# Altium schematic sheet Multiplexor_USBD_Maestro.SchDoc
size A4; SheetNumber: 17; SheetTotal: 22
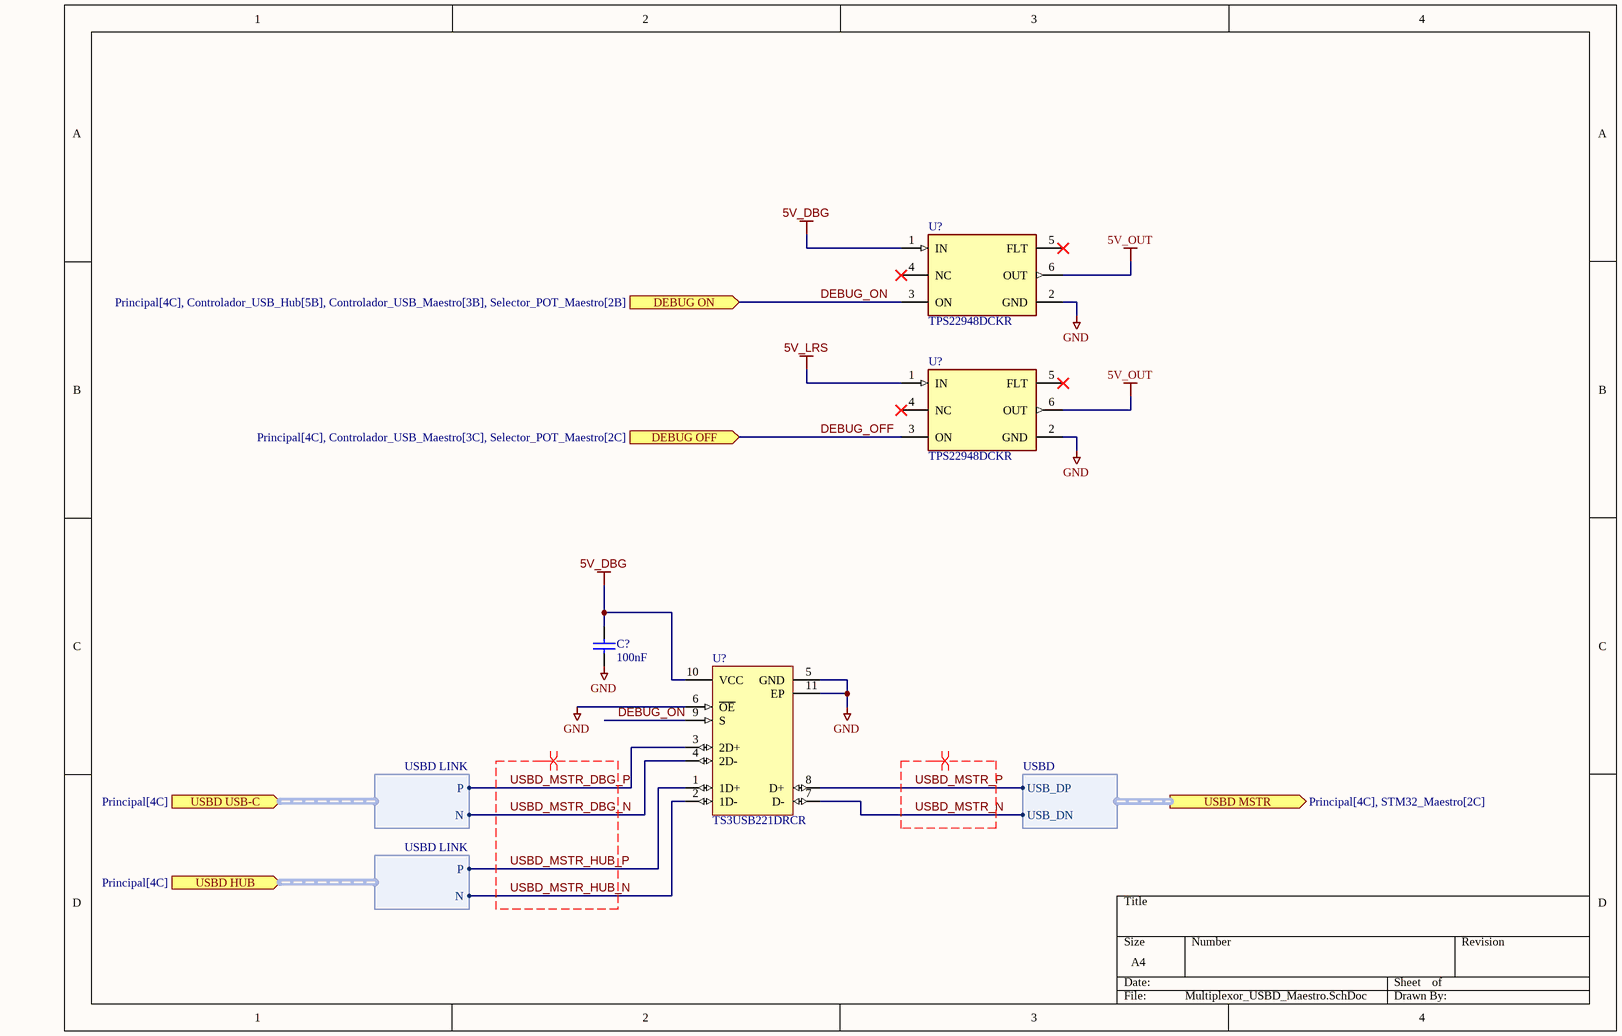
[diagram p0: Multiplexor_USBD_Maestro.SchDoc]

## Parts
(Parts that share a designator on the sheet are numbered #1, #2 ... from top to bottom, then left to right.)
C?  100nF  [CAPC1005X55X25NL05T05]
U?#1  TPS22948DCKR  [FP-DCK0006A-MFG]
U?#2  TPS22948DCKR  [FP-DCK0006A-MFG]
U?#3  TS3USB221DRCR  [DRC0010J_V]

## Ports
DEBUG OFF (in, see Principal[4C], Controlador_USB_Maestro[3C], Selector_POT_Maestro[2C]), DEBUG ON (in, see Principal[4C], Controlador_USB_Hub[5B], Controlador_USB_Maestro[3B], Selector_POT_Maestro[2B]), USBD HUB (in, harness USBD LINK, see Principal[4C]), USBD MSTR (out, harness USBD, see Principal[4C], STM32_Maestro[2C]), USBD USB-C (in, harness USBD LINK, see Principal[4C])

## Harnesses
USBD: USB_DP, USB_DN
USBD LINK: P, N

## Nets
5V_DBG: C?.2 U?#1.1(IN) U?#3.10(VCC)
5V_LRS: U?#2.1(IN)
5V_OUT: U?#1.6(OUT) U?#2.6(OUT)
GND: C?.1 U?#1.2(GND) U?#2.2(GND) U?#3.5(GND) U?#3.6(~{OE}) U?#3.11(EP)
DEBUG_OFF: U?#2.3(ON) ; port DEBUG OFF
DEBUG_ON: U?#1.3(ON) U?#3.9(S) ; port DEBUG ON
USBD_MSTR_DBG_N: U?#3.4(2D-) ; port USBD USB-C.N
USBD_MSTR_DBG_P: U?#3.3(2D+) ; port USBD USB-C.P
USBD_MSTR_HUB_N: U?#3.2(1D-) ; port USBD HUB.N
USBD_MSTR_HUB_P: U?#3.1(1D+) ; port USBD HUB.P
USBD_MSTR_N: U?#3.7(D-) ; port USBD MSTR.USB_DN
USBD_MSTR_P: U?#3.8(D+) ; port USBD MSTR.USB_DP

Not connected (* = marked no-connect by the designer): U?#1 4(NC)* 5(FLT)*; U?#2 4(NC)* 5(FLT)*

## Layout directives
differential pair: USBD_MSTR_DBG_N, USBD_MSTR_DBG_P, USBD_MSTR_HUB_N, USBD_MSTR_HUB_P, USBD_MSTR_N, USBD_MSTR_P

## Library data of the parts
C? = CMP-2008-02030-1: Manufacturer: Vitramon; Part Number: VJ0402Y104KXJCW1BC
U?#1 U?#2 = CMP-04910-000046-1: IC POWER MANAGEMENT
U?#3 = CMP-0309-00084-2: High-Speed USB 2.0 (480 Mbps) 1:2 Multiplexer / Demultiplexer Switch with Single Enable, 6 ohm RON, 2.5 to 3.3V, -40 to 85 degC, 10-Pin SON (DRC), Green (RoHS & no Sb/Br); Manufacturer: Texas Instruments; Number of Channels: 2; ON Time(Max)(ns): 30; SubFamily: USB Switch; RON Mis-match(Max)(Ohms): 0.2; Vcc range(V): 2.3 to 3.6; tpd max(ns): 0.25; OFF Time(Max)(ns): 12; ron(max)(ohms): 6; ESD HBM(kV): +/-2; Architecture: "1","2 mux/demux"; RON Flatness(Max)(Ohms): 1; Bandwidth(MHz): 1200; IL OFF(Max)(nA): 2; PackageVersion: revL, Sep-2011; Mounting Technology: Surface Mount; ICC(uA): 30; DatasheetVersion: SCDS220G; PartNumber: TS3USB221DRCR; Charge Injection(Max)(pC): N/A; ComponentLink1Description: Datasheet; PackageDescription: 10-Pin Plastic Small Outline No-Lead, 3 x 3 x 1 mm Body, 0.5 mm Pitch, Exposed Pad; ComponentLink2URL: http://www.ti.com/litv/pdf/mpds117k; Eco-Plan: Green (RoHS & no Sb/Br); ComponentLink2Description: Package Specification; ComponentLink1URL: http://www.ti.com/general/docs/lit/getliterature.tsp?genericPartNumber=TS3USB221&fileType=pdf; PackageReference: DRC0010J